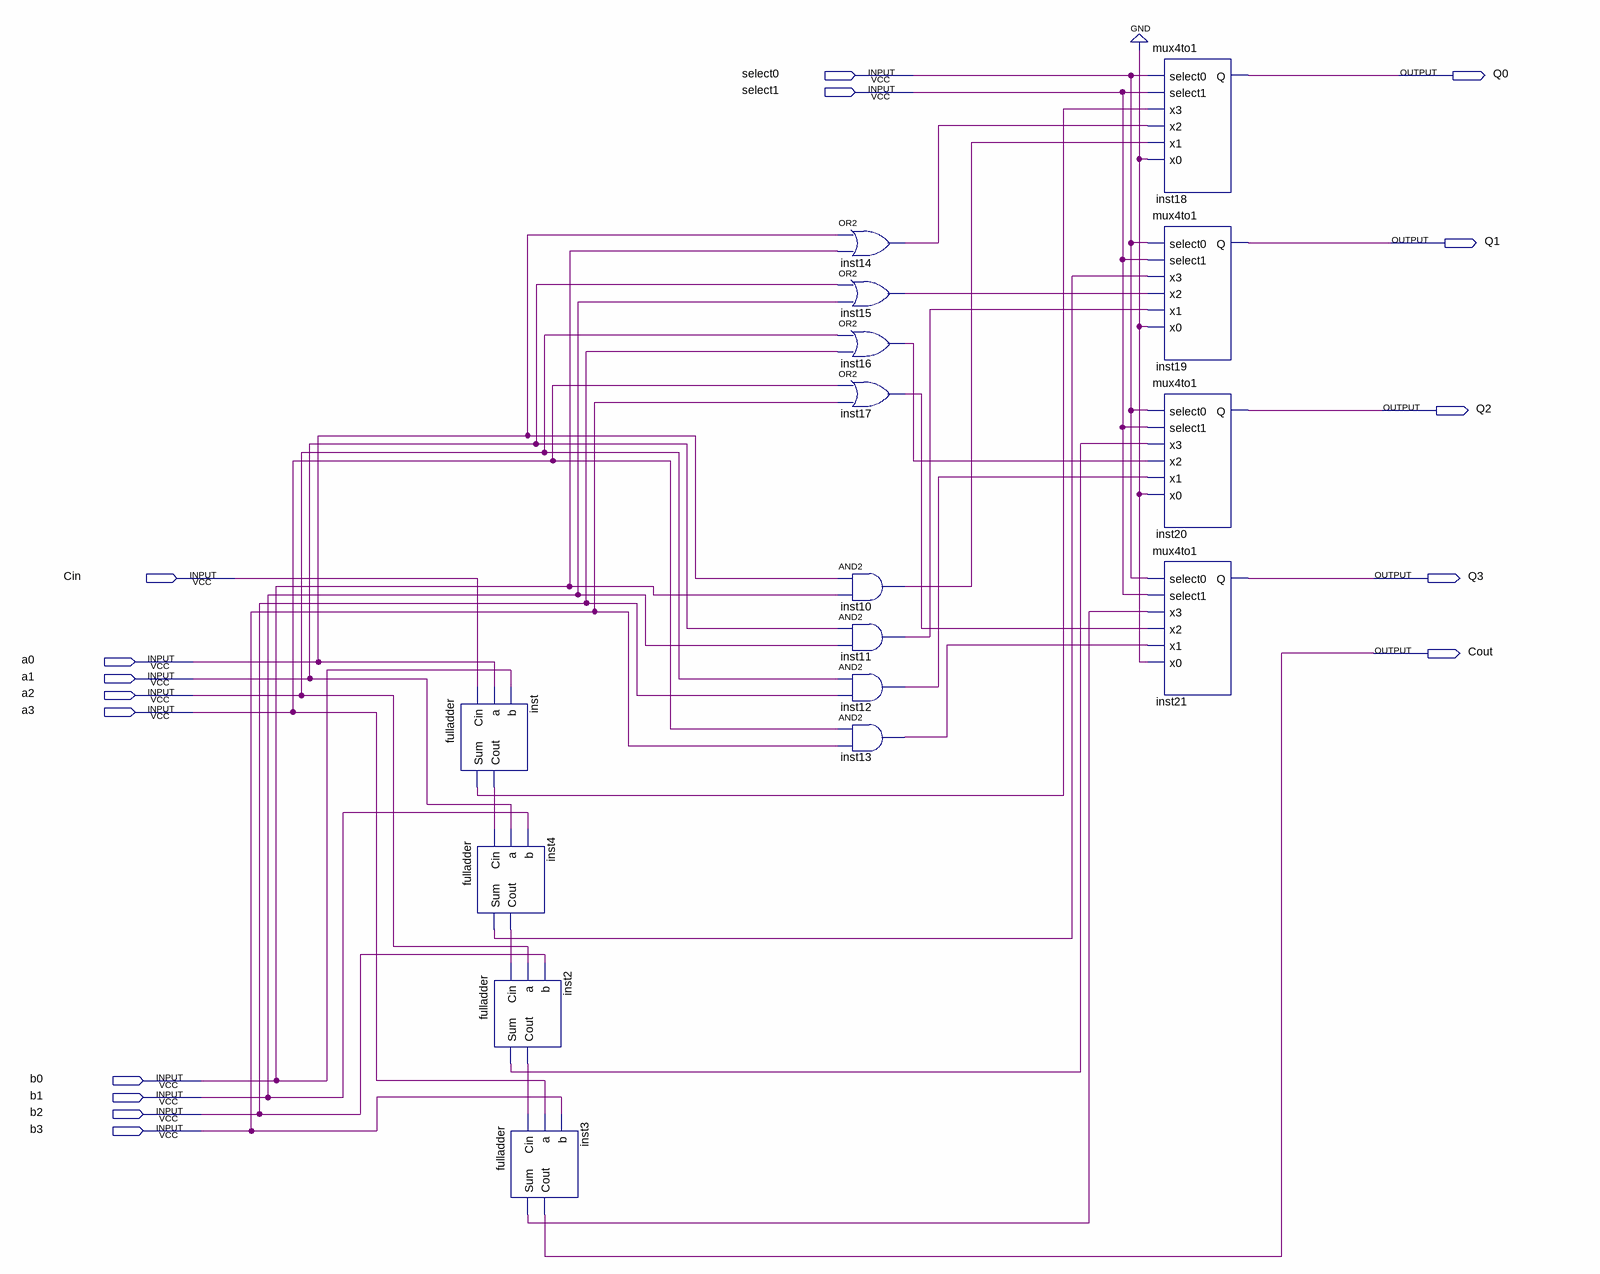
[diagram p0: schematic sheet]
// Quartus schematic alu4bit.bdf as structural Verilog: 16 symbols, 16 pins
module alu4bit (
  input  select0,
  input  select1,
  input  Cin,
  input  a0,
  input  a1,
  input  a2,
  input  a3,
  input  b0,
  input  b1,
  input  b2,
  input  b3,
  output Q0,
  output Q1,
  output Q2,
  output Q3,
  output Cout
);

  wire inst2_cout, inst2_sum, inst3_sum, inst4_cout, inst4_sum, inst10_out, inst11_out, inst12_out,
       inst13_out, inst14_out, inst15_out, inst16_out, inst17_out, inst_cout, inst_sum;

  fulladder inst (.Cin(Cin), .a(a0), .b(b0), .Sum(inst_sum), .Cout(inst_cout));
  fulladder inst4 (.Cin(inst_cout), .a(a1), .b(b1), .Sum(inst4_sum), .Cout(inst4_cout));
  fulladder inst2 (.Cin(inst4_cout), .a(a2), .b(b2), .Sum(inst2_sum), .Cout(inst2_cout));
  fulladder inst3 (.Cin(inst2_cout), .a(a3), .b(b3), .Sum(inst3_sum), .Cout(Cout));
  or inst14 (inst14_out, a0, b0);
  or inst15 (inst15_out, a1, b1);
  or inst16 (inst16_out, a2, b2);
  or inst17 (inst17_out, a3, b3);
  and inst10 (inst10_out, a0, b0);
  and inst11 (inst11_out, a1, b1);
  and inst12 (inst12_out, a2, b2);
  and inst13 (inst13_out, a3, b3);
  mux4to1 inst18 (
    .select0(select0), .select1(select1), .x3(inst_sum), .x2(inst14_out), .x1(inst10_out), .x0(1'b0), .Q(Q0));
  mux4to1 inst19 (
    .select0(select0), .select1(select1), .x3(inst4_sum), .x2(inst15_out), .x1(inst11_out), .x0(1'b0), .Q(Q1));
  mux4to1 inst20 (
    .select0(select0), .select1(select1), .x3(inst2_sum), .x2(inst16_out), .x1(inst12_out), .x0(1'b0), .Q(Q2));
  mux4to1 inst21 (
    .select0(select0), .select1(select1), .x3(inst3_sum), .x2(inst17_out), .x1(inst13_out), .x0(1'b0), .Q(Q3));
endmodule
